# EAGLE schematic Super-Regenerative-VHF-2Transistor-RickAndersen-October2006-old (EAGLE 7.2.0)
A Superregen Receiver for FM broadcast or Aircraft band AM reception http://www.ke3ij.com/superrgn.htm
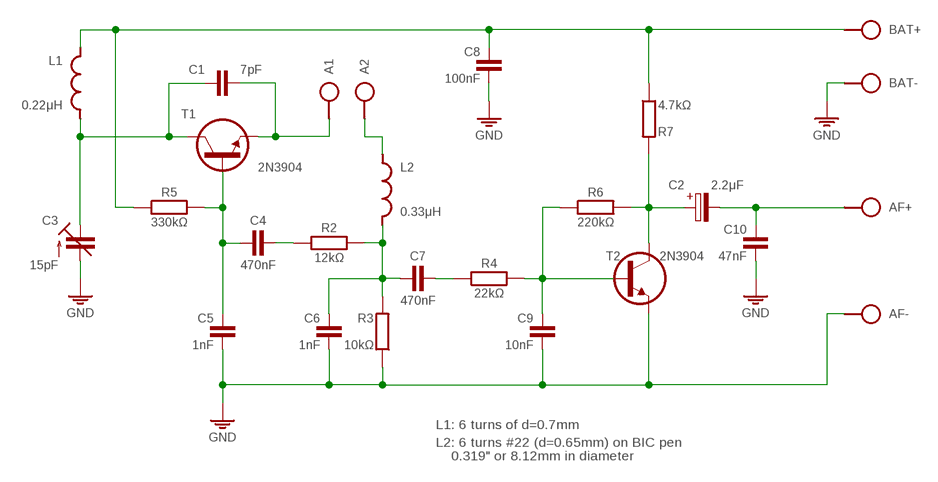
[diagram p0: schematic, sheet 1]

## Parts
A1  SPAD  [SPAD]
A2  SPAD  [SPAD]
AF+  SPAD  [SPAD]
AF-  SPAD  [SPAD]
BAT+  SPAD  [SPAD]
BAT-  SPAD  [SPAD]
C1  7pF  C050-020X036  [C050-020X036]
C2  2.2μF  CPOLE2,5-3  [E2,5-3]
C3  15pF  C-TR-PH201272222-808-2PINB  [TRIM-2222-808]
C4  470nF  C050-024X044/V  [C050-024X044/V]
C5  1nF  C025-020X036  [C025-020X036]
C6  1nF  C025-020X036  [C025-020X036]
C7  470nF  C050-024X044/V  [C050-024X044/V]
C8  100nF  C050-020X044  [C050-020X044]
C9  10nF  C025-015X024  [C025-015X024]
C10  47nF  C050-020X036/V  [C050-020X036/V]
L1  0.22μH  L-SHORT04-5/5V  [L-04-5/6V]
L2  0.33μH  L-SHORTL-08-5/8  [L-08-5/8]
R2  12kΩ  R-H0202/7  [0202/7]
R3  10kΩ  R0202/5-V  [0202/5-V]
R4  22kΩ  R-H0202/7-V  [0202/7-V]
R5  330kΩ  R-H0202/7  [0202/7]
R6  220kΩ  R-H0202/7-V  [0202/7-V]
R7  4.7kΩ  R0202/7-V  [0202/7-V]
T1  2N3904  [TO92]
T2  2N3904  [TO92]

## Nets
GND: AF-.1 BAT-.1 C3.2(A) C5.2 C6.2 C8.2 C9.2 C10.2 R3.1 T2.1(E)
N$1: C1.2 C3.3(E) L1.2 T1.3(C)
N$2: A1.1 C1.1 T1.1(E)
N$3: C7.1 R4.1
N$4: C4.2 C5.1 R5.2 T1.2(B)
N$5: C2.+ R6.2 R7.2 T2.3(C)
N$6: C6.1 C7.2 L2.1 R2.2 R3.2
N$7: C4.1 R2.1
N$8: A2.1 L2.2
N$10: C9.1 R4.2 R6.1 T2.2(B)
N$11: AF+.1 C2.- C10.1
VCC: BAT+.1 C8.1 L1.1 R5.1 R7.1

## Notes on the sheet
- L1: 6 turns of d=0.7mm
- L2: 6 turns #22 (d=0.65mm) on BIC pen
      0.319" or 8.12mm in diameter

## Library data of the parts
A1 A2 AF+ AF- BAT+ BAT- = pad:SPAD
C1 C4-C10 = c:C: CAPACITOR, European symbol
C2 = c:CPOL: POLARIZED CAPACITOR, European symbol
C3 = cap-trim:C-TR-PH20127
L1 L2 = l:L-SHORT
R2 R4-R6 = r:R-H
R3 R7 = r:R: RESISTOR, European symbol
T1 T2 = t:2N3904

## Net classes
0 default: width 0.61 mm